# Altium schematic sheet Connector A.SchDoc: CONNECTOR A
size A2; DrawnBy: ELIO F.; Engineer: ELIO F.; Revision: A; SheetNumber: 14; SheetTotal: 21
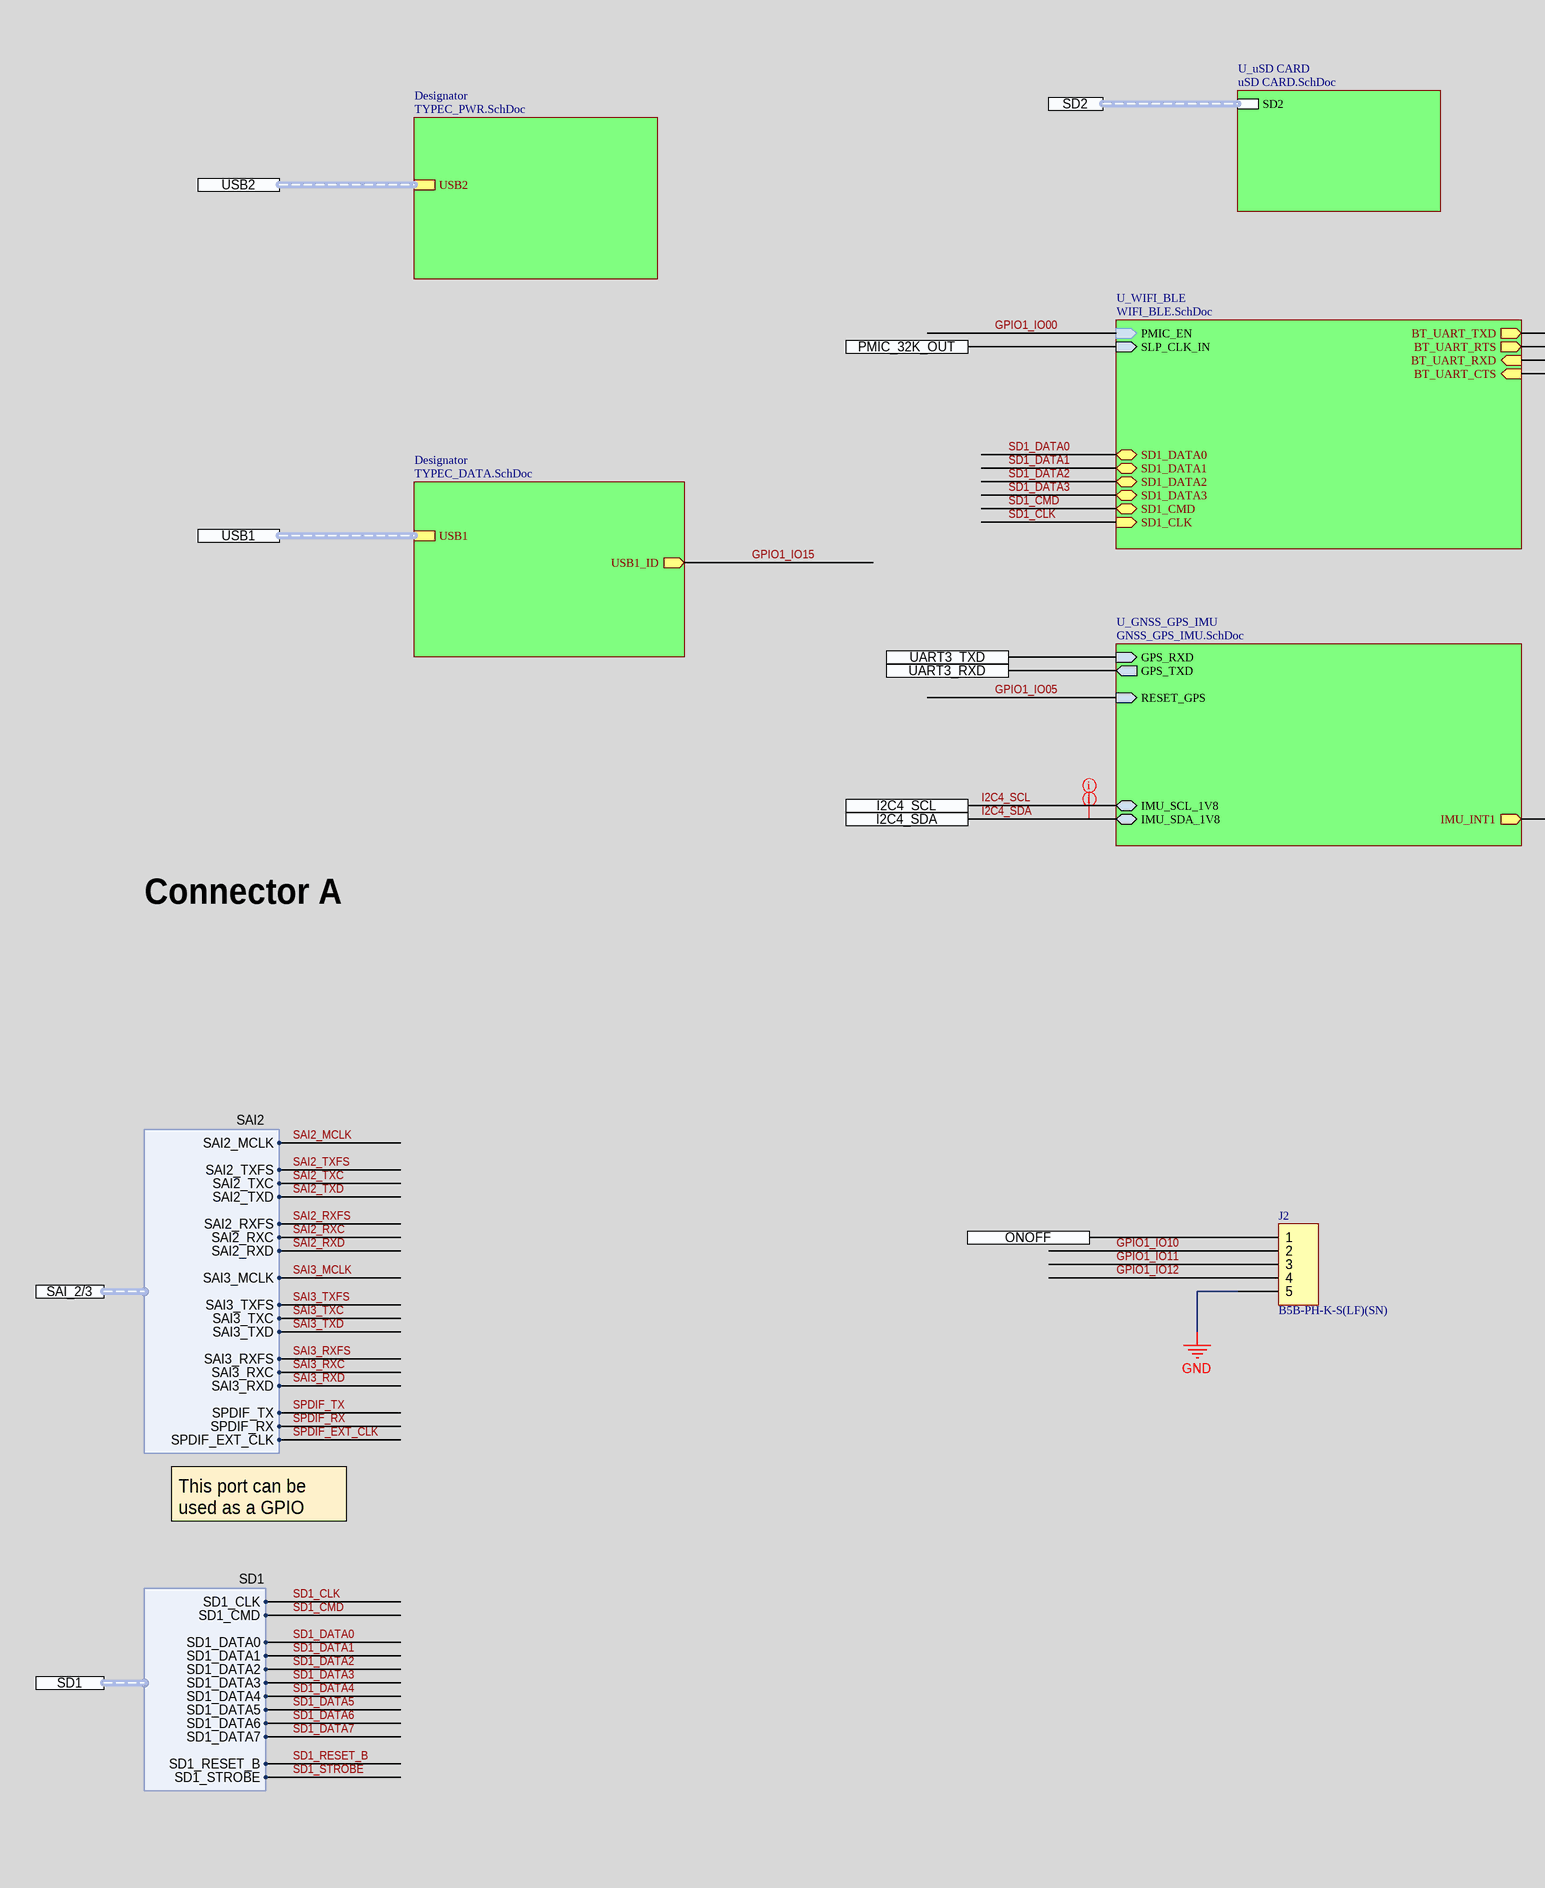
[diagram p0: Connector A.SchDoc, left]
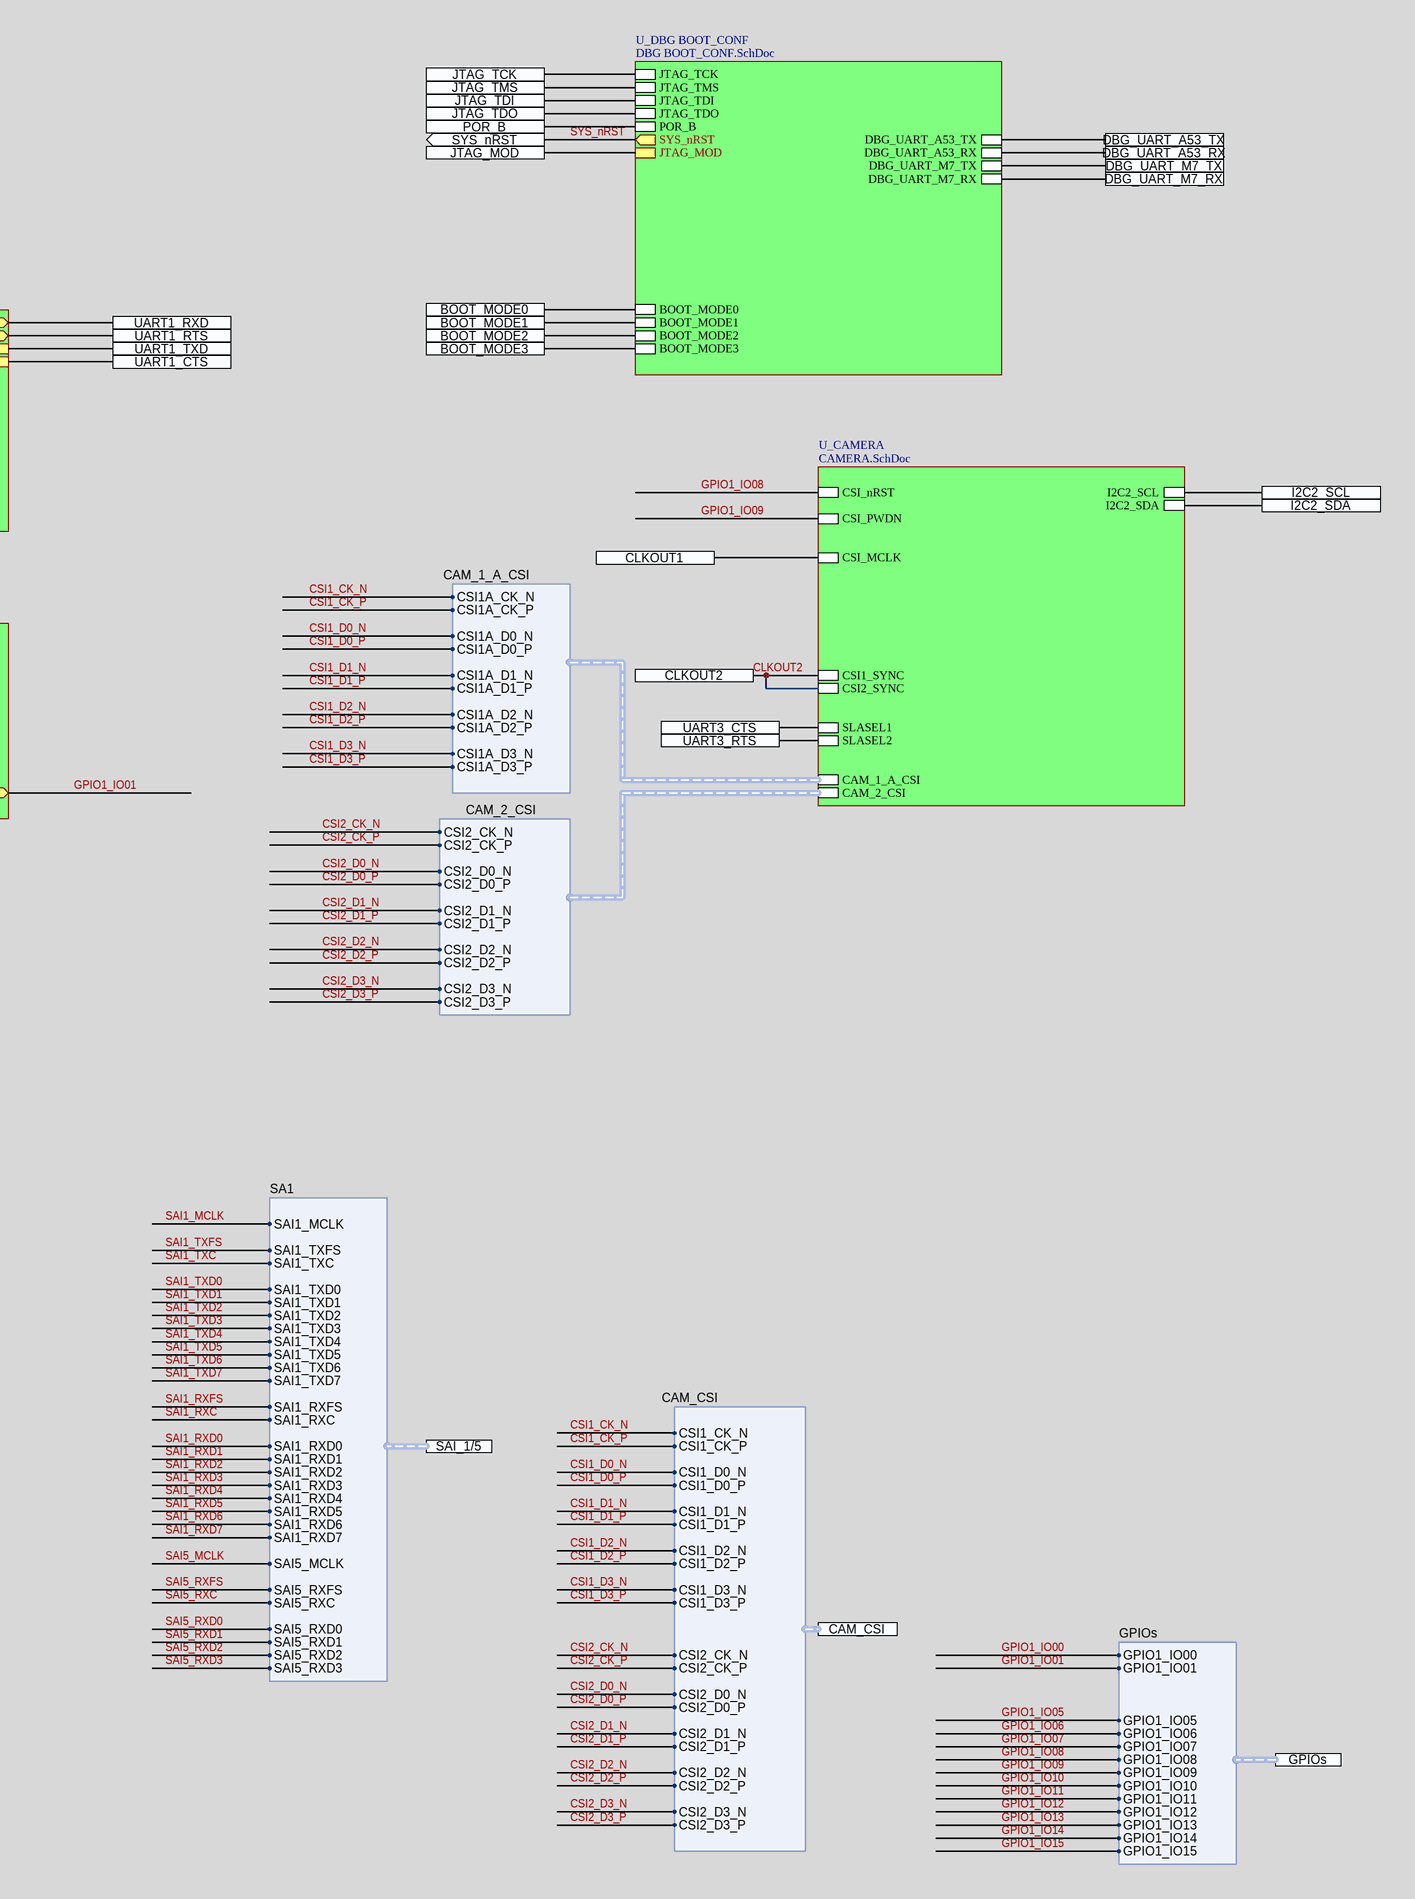
[diagram p1: Connector A.SchDoc, right]

## Parts
J2  B5B-PH-K-S(LF)(SN)  [JST B5B-PH-K]

## Sub-sheets
Designator = TYPEC_PWR.SchDoc: USB2 (harness USB1)
Designator = TYPEC_DATA.SchDoc: USB1 (harness USB1), USB1_ID (out)
U_CAMERA = CAMERA.SchDoc: CSI_PWDN, CSI1_SYNC, CSI_MCLK, CSI_nRST, I2C2_SDA, I2C2_SCL, SLASEL1, CSI2_SYNC, SLASEL2, CAM_2_CSI (harness CAM_2_CSI), CAM_1_A_CSI (harness CAM_1_A_CSI)
U_DBG BOOT_CONF = DBG BOOT_CONF.SchDoc: JTAG_TCK, JTAG_TMS, JTAG_TDI, JTAG_TDO, POR_B, DBG_UART_A53_TX, DBG_UART_A53_RX, DBG_UART_M7_RX, DBG_UART_M7_TX, BOOT_MODE0, BOOT_MODE1, BOOT_MODE2, BOOT_MODE3, SYS_nRST (out), JTAG_MOD
U_GNSS_GPS_IMU = GNSS_GPS_IMU.SchDoc: IMU_SCL_1V8 (bidir), IMU_SDA_1V8 (bidir), IMU_INT1 (out), GPS_TXD (out), GPS_RXD (in), RESET_GPS (in)
U_uSD CARD = uSD CARD.SchDoc: SD2 (harness SD2)
U_WIFI_BLE = WIFI_BLE.SchDoc: PMIC_EN (in), SLP_CLK_IN (in), SD1_DATA0 (bidir), SD1_DATA1 (bidir), SD1_DATA2 (bidir), SD1_DATA3 (bidir), SD1_CMD (bidir), SD1_CLK (in), BT_UART_CTS (in), BT_UART_RXD (in), BT_UART_TXD (out), BT_UART_RTS (out)

## Ports
BOOT_MODE0, BOOT_MODE1, BOOT_MODE2, BOOT_MODE3, CAM_CSI (harness CAM_CSI), CLKOUT1, CLKOUT2, DBG_UART_A53_RX, DBG_UART_A53_TX, DBG_UART_M7_RX, DBG_UART_M7_TX, GPIOs (harness GPIOs), I2C2_SCL, I2C2_SDA, I2C4_SCL, I2C4_SDA, JTAG_MOD, JTAG_TCK, JTAG_TDI, JTAG_TDO, JTAG_TMS, ONOFF, PMIC_32K_OUT, POR_B, SAI_1/5 (harness SA1), SAI_2/3 (harness SAI2), SD1 (harness SD1), SD2 (harness SD2), SYS_nRST (out), UART1_CTS, UART1_RTS, UART1_RXD, UART1_TXD, UART3_CTS, UART3_RTS, UART3_RXD, UART3_TXD, USB1 (harness USB1), USB2 (harness USB2)

## Harnesses
SAI2: SAI2_MCLK, SAI2_TXFS, SAI2_TXC, SAI2_TXD, SAI2_RXFS, SAI2_RXC, SAI2_RXD, SAI3_MCLK, SAI3_TXFS, SAI3_TXC, SAI3_TXD, SAI3_RXFS, SAI3_RXC, SAI3_RXD, SPDIF_TX, SPDIF_RX, SPDIF_EXT_CLK
SD1: SD1_CMD, SD1_DATA0, SD1_DATA1, SD1_DATA2, SD1_DATA3, SD1_DATA4, SD1_DATA6, SD1_DATA7, SD1_RESET_B, SD1_STROBE, SD1_CLK, SD1_DATA5
SA1: SAI1_MCLK, SAI1_TXFS, SAI1_TXC, SAI1_TXD0, SAI1_TXD1, SAI1_TXD2, SAI1_TXD3, SAI1_TXD4, SAI1_TXD5, SAI1_TXD6, SAI1_TXD7, SAI1_RXFS, SAI1_RXC, SAI1_RXD0, SAI1_RXD1, SAI1_RXD2, SAI1_RXD3, SAI1_RXD4, SAI1_RXD5, SAI1_RXD6, SAI1_RXD7, SAI5_MCLK, SAI5_RXFS, SAI5_RXC, SAI5_RXD0, SAI5_RXD1, SAI5_RXD2, SAI5_RXD3
CAM_CSI: CSI1_CK_N, CSI1_CK_P, CSI1_D0_N, CSI1_D0_P, CSI1_D1_N, CSI1_D1_P, CSI1_D2_N, CSI1_D2_P, CSI1_D3_N, CSI1_D3_P, CSI2_CK_N, CSI2_CK_P, CSI2_D0_N, CSI2_D0_P, CSI2_D1_N, CSI2_D1_P, CSI2_D2_N, CSI2_D2_P, CSI2_D3_N, CSI2_D3_P
GPIOs: GPIO1_IO00, GPIO1_IO01, GPIO1_IO05, GPIO1_IO06, GPIO1_IO07, GPIO1_IO08, GPIO1_IO09, GPIO1_IO10, GPIO1_IO11, GPIO1_IO12, GPIO1_IO13, GPIO1_IO14, GPIO1_IO15
CAM_2_CSI: CSI2_CK_N, CSI2_CK_P, CSI2_D0_N, CSI2_D0_P, CSI2_D1_N, CSI2_D1_P, CSI2_D2_N, CSI2_D2_P, CSI2_D3_N, CSI2_D3_P
CAM_1_A_CSI: CSI1A_CK_N, CSI1A_CK_P, CSI1A_D0_N, CSI1A_D0_P, CSI1A_D1_N, CSI1A_D1_P, CSI1A_D2_N, CSI1A_D2_P, CSI1A_D3_N, CSI1A_D3_P

## Nets
GND: J2.5
BOOT_MODE0: port BOOT_MODE0, sheet U_DBG BOOT_CONF/BOOT_MODE0
BOOT_MODE1: port BOOT_MODE1, sheet U_DBG BOOT_CONF/BOOT_MODE1
BOOT_MODE2: port BOOT_MODE2, sheet U_DBG BOOT_CONF/BOOT_MODE2
BOOT_MODE3: port BOOT_MODE3, sheet U_DBG BOOT_CONF/BOOT_MODE3
CLKOUT1: port CLKOUT1, sheet U_CAMERA/CSI_MCLK
CLKOUT2: port CLKOUT2, sheet U_CAMERA/CSI1_SYNC, sheet U_CAMERA/CSI2_SYNC
CSI1_CK_N: port CAM_CSI.CSI1_CK_N, sheet U_CAMERA/CAM_1_A_CSI.CSI1A_CK_N
CSI1_CK_P: port CAM_CSI.CSI1_CK_P, sheet U_CAMERA/CAM_1_A_CSI.CSI1A_CK_P
CSI1_D0_N: port CAM_CSI.CSI1_D0_N, sheet U_CAMERA/CAM_1_A_CSI.CSI1A_D0_N
CSI1_D0_P: port CAM_CSI.CSI1_D0_P, sheet U_CAMERA/CAM_1_A_CSI.CSI1A_D0_P
CSI1_D1_N: port CAM_CSI.CSI1_D1_N, sheet U_CAMERA/CAM_1_A_CSI.CSI1A_D1_N
CSI1_D1_P: port CAM_CSI.CSI1_D1_P, sheet U_CAMERA/CAM_1_A_CSI.CSI1A_D1_P
CSI1_D2_N: port CAM_CSI.CSI1_D2_N, sheet U_CAMERA/CAM_1_A_CSI.CSI1A_D2_N
CSI1_D2_P: port CAM_CSI.CSI1_D2_P, sheet U_CAMERA/CAM_1_A_CSI.CSI1A_D2_P
CSI1_D3_N: port CAM_CSI.CSI1_D3_N, sheet U_CAMERA/CAM_1_A_CSI.CSI1A_D3_N
CSI1_D3_P: port CAM_CSI.CSI1_D3_P, sheet U_CAMERA/CAM_1_A_CSI.CSI1A_D3_P
CSI2_CK_N: port CAM_CSI.CSI2_CK_N, sheet U_CAMERA/CAM_2_CSI.CSI2_CK_N
CSI2_CK_P: port CAM_CSI.CSI2_CK_P, sheet U_CAMERA/CAM_2_CSI.CSI2_CK_P
CSI2_D0_N: port CAM_CSI.CSI2_D0_N, sheet U_CAMERA/CAM_2_CSI.CSI2_D0_N
CSI2_D0_P: port CAM_CSI.CSI2_D0_P, sheet U_CAMERA/CAM_2_CSI.CSI2_D0_P
CSI2_D1_N: port CAM_CSI.CSI2_D1_N, sheet U_CAMERA/CAM_2_CSI.CSI2_D1_N
CSI2_D1_P: port CAM_CSI.CSI2_D1_P, sheet U_CAMERA/CAM_2_CSI.CSI2_D1_P
CSI2_D2_N: port CAM_CSI.CSI2_D2_N, sheet U_CAMERA/CAM_2_CSI.CSI2_D2_N
CSI2_D2_P: port CAM_CSI.CSI2_D2_P, sheet U_CAMERA/CAM_2_CSI.CSI2_D2_P
CSI2_D3_N: port CAM_CSI.CSI2_D3_N, sheet U_CAMERA/CAM_2_CSI.CSI2_D3_N
CSI2_D3_P: port CAM_CSI.CSI2_D3_P, sheet U_CAMERA/CAM_2_CSI.CSI2_D3_P
DBG_UART_A53_RX: port DBG_UART_A53_RX, sheet U_DBG BOOT_CONF/DBG_UART_A53_RX
DBG_UART_A53_TX: port DBG_UART_A53_TX, sheet U_DBG BOOT_CONF/DBG_UART_A53_TX
DBG_UART_M7_RX: port DBG_UART_M7_RX, sheet U_DBG BOOT_CONF/DBG_UART_M7_RX
DBG_UART_M7_TX: port DBG_UART_M7_TX, sheet U_DBG BOOT_CONF/DBG_UART_M7_TX
GPIO1_IO00: sheet U_WIFI_BLE/PMIC_EN, port GPIOs.GPIO1_IO00
GPIO1_IO01: sheet U_GNSS_GPS_IMU/IMU_INT1, port GPIOs.GPIO1_IO01
GPIO1_IO05: sheet U_GNSS_GPS_IMU/RESET_GPS, port GPIOs.GPIO1_IO05
GPIO1_IO06: port GPIOs.GPIO1_IO06
GPIO1_IO07: port GPIOs.GPIO1_IO07
GPIO1_IO08: sheet U_CAMERA/CSI_nRST, port GPIOs.GPIO1_IO08
GPIO1_IO09: sheet U_CAMERA/CSI_PWDN, port GPIOs.GPIO1_IO09
GPIO1_IO10: J2.2 ; port GPIOs.GPIO1_IO10
GPIO1_IO11: J2.3 ; port GPIOs.GPIO1_IO11
GPIO1_IO12: J2.4 ; port GPIOs.GPIO1_IO12
GPIO1_IO13: port GPIOs.GPIO1_IO13
GPIO1_IO14: port GPIOs.GPIO1_IO14
GPIO1_IO15: sheet Designator/USB1_ID, port GPIOs.GPIO1_IO15
I2C2_SCL: port I2C2_SCL, sheet U_CAMERA/I2C2_SCL
I2C2_SDA: port I2C2_SDA, sheet U_CAMERA/I2C2_SDA
I2C4_SCL: port I2C4_SCL, sheet U_GNSS_GPS_IMU/IMU_SCL_1V8
I2C4_SDA: port I2C4_SDA, sheet U_GNSS_GPS_IMU/IMU_SDA_1V8
JTAG_MOD: port JTAG_MOD, sheet U_DBG BOOT_CONF/JTAG_MOD
JTAG_TCK: port JTAG_TCK, sheet U_DBG BOOT_CONF/JTAG_TCK
JTAG_TDI: port JTAG_TDI, sheet U_DBG BOOT_CONF/JTAG_TDI
JTAG_TDO: port JTAG_TDO, sheet U_DBG BOOT_CONF/JTAG_TDO
JTAG_TMS: port JTAG_TMS, sheet U_DBG BOOT_CONF/JTAG_TMS
ONOFF: J2.1 ; port ONOFF
PMIC_32K_OUT: port PMIC_32K_OUT, sheet U_WIFI_BLE/SLP_CLK_IN
POR_B: port POR_B, sheet U_DBG BOOT_CONF/POR_B
SAI1_MCLK: port SAI_1/5.SAI1_MCLK
SAI1_RXC: port SAI_1/5.SAI1_RXC
SAI1_RXD0: port SAI_1/5.SAI1_RXD0
SAI1_RXD1: port SAI_1/5.SAI1_RXD1
SAI1_RXD2: port SAI_1/5.SAI1_RXD2
SAI1_RXD3: port SAI_1/5.SAI1_RXD3
SAI1_RXD4: port SAI_1/5.SAI1_RXD4
SAI1_RXD5: port SAI_1/5.SAI1_RXD5
SAI1_RXD6: port SAI_1/5.SAI1_RXD6
SAI1_RXD7: port SAI_1/5.SAI1_RXD7
SAI1_RXFS: port SAI_1/5.SAI1_RXFS
SAI1_TXC: port SAI_1/5.SAI1_TXC
SAI1_TXD0: port SAI_1/5.SAI1_TXD0
SAI1_TXD1: port SAI_1/5.SAI1_TXD1
SAI1_TXD2: port SAI_1/5.SAI1_TXD2
SAI1_TXD3: port SAI_1/5.SAI1_TXD3
SAI1_TXD4: port SAI_1/5.SAI1_TXD4
SAI1_TXD5: port SAI_1/5.SAI1_TXD5
SAI1_TXD6: port SAI_1/5.SAI1_TXD6
SAI1_TXD7: port SAI_1/5.SAI1_TXD7
SAI1_TXFS: port SAI_1/5.SAI1_TXFS
SAI2_MCLK: port SAI_2/3.SAI2_MCLK
SAI2_RXC: port SAI_2/3.SAI2_RXC
SAI2_RXD: port SAI_2/3.SAI2_RXD
SAI2_RXFS: port SAI_2/3.SAI2_RXFS
SAI2_TXC: port SAI_2/3.SAI2_TXC
SAI2_TXD: port SAI_2/3.SAI2_TXD
SAI2_TXFS: port SAI_2/3.SAI2_TXFS
SAI3_MCLK: port SAI_2/3.SAI3_MCLK
SAI3_RXC: port SAI_2/3.SAI3_RXC
SAI3_RXD: port SAI_2/3.SAI3_RXD
SAI3_RXFS: port SAI_2/3.SAI3_RXFS
SAI3_TXC: port SAI_2/3.SAI3_TXC
SAI3_TXD: port SAI_2/3.SAI3_TXD
SAI3_TXFS: port SAI_2/3.SAI3_TXFS
SAI5_MCLK: port SAI_1/5.SAI5_MCLK
SAI5_RXC: port SAI_1/5.SAI5_RXC
SAI5_RXD0: port SAI_1/5.SAI5_RXD0
SAI5_RXD1: port SAI_1/5.SAI5_RXD1
SAI5_RXD2: port SAI_1/5.SAI5_RXD2
SAI5_RXD3: port SAI_1/5.SAI5_RXD3
SAI5_RXFS: port SAI_1/5.SAI5_RXFS
SD1_CLK: sheet U_WIFI_BLE/SD1_CLK, port SD1.SD1_CLK
SD1_CMD: sheet U_WIFI_BLE/SD1_CMD, port SD1.SD1_CMD
SD1_DATA0: sheet U_WIFI_BLE/SD1_DATA0, port SD1.SD1_DATA0
SD1_DATA1: sheet U_WIFI_BLE/SD1_DATA1, port SD1.SD1_DATA1
SD1_DATA2: sheet U_WIFI_BLE/SD1_DATA2, port SD1.SD1_DATA2
SD1_DATA3: sheet U_WIFI_BLE/SD1_DATA3, port SD1.SD1_DATA3
SD1_DATA4: port SD1.SD1_DATA4
SD1_DATA5: port SD1.SD1_DATA5
SD1_DATA6: port SD1.SD1_DATA6
SD1_DATA7: port SD1.SD1_DATA7
SD1_RESET_B: port SD1.SD1_RESET_B
SD1_STROBE: port SD1.SD1_STROBE
SPDIF_EXT_CLK: port SAI_2/3.SPDIF_EXT_CLK
SPDIF_RX: port SAI_2/3.SPDIF_RX
SPDIF_TX: port SAI_2/3.SPDIF_TX
SYS_nRST: port SYS_nRST, sheet U_DBG BOOT_CONF/SYS_nRST
UART1_CTS: port UART1_CTS, sheet U_WIFI_BLE/BT_UART_CTS
UART1_RTS: port UART1_RTS, sheet U_WIFI_BLE/BT_UART_RTS
UART1_RXD: port UART1_RXD, sheet U_WIFI_BLE/BT_UART_TXD
UART1_TXD: port UART1_TXD, sheet U_WIFI_BLE/BT_UART_RXD
UART3_CTS: port UART3_CTS, sheet U_CAMERA/SLASEL1
UART3_RTS: port UART3_RTS, sheet U_CAMERA/SLASEL2
UART3_RXD: port UART3_RXD, sheet U_GNSS_GPS_IMU/GPS_TXD
UART3_TXD: port UART3_TXD, sheet U_GNSS_GPS_IMU/GPS_RXD

## Buses and harness runs
harness port SD2 = sheet U_uSD CARD/SD2
harness port USB1 = sheet Designator/USB1
harness port USB2 = sheet Designator/USB2

## Layout directives
net class IMU: I2C4_SCL, I2C4_SDA

## Notes on the sheet
- Connector A
- This port can be used as a GPIO Port
- PCB Des :
- Approv By :
- Project Title :
- Sheet Title :
- Date :
- PCB Version :
- Size :
- A4
- Page :
- PCB Revision :

## Library data of the parts
J2 = B5B-PH-K-S(LF)(SN): CONN HEADER VERT 5POS 2MM; Manufacturer: JST Sales America Inc.; Contact Length - Mating: 0.130" (3.30mm); Contact Length - Post: 0.134" (3.40mm); Current Rating (Amps): 2A; Material Flammability Rating: UL94 V-0; Number of Positions: 5; Number of Positions Loaded: All; Overall Contact Length: 0.333" (8.45mm); Pitch - Mating: 0.079" (2.00mm); Shrouding: Shrouded - 4 Wall; Style: Board to Cable/Wire; Voltage Rating: 100V; Part Number: B5B-PH-K-S(LF)(SN); ComponentLink1Description: Datasheet; ComponentLink1URL: http://www.jst-mfg.com/product/pdf/eng/ePH.pdf; ComponentLink2Description: DigiKey Link; ComponentLink2URL: http://digikey.com/product-detail/en/jst-sales-america-inc/B5B-PH-K-S-LF-SN/455-1707-ND/926614; Connector Type: Header; Contact Finish - Mating: Tin; Contact Finish - Post: Tin; Contact Material: Brass; Contact Shape: Square; Contact Type: Male Pin; Fastening Type: Detent Lock; Insulation Color: Natural; Insulation Height: 0.236" (6.00mm); Insulation Material: Polyamide (PA66), Nylon 6/6; LastUpdated: 1/12/2020 10:30:05 PM; Lifecycle Status: Active; Minimum Order: 1; Mounting Type: Through Hole; Number of Rows: 1; Operating Temperature: -25°C ~ 85°C; Packaging: Bulk; PartId: 28; Part Status: Active; Price: 0.29; Series: PH; Supplier 1: DigiKey; Supplier Part Number 1: 455-1707-ND; Termination: Press-Fit, Solder